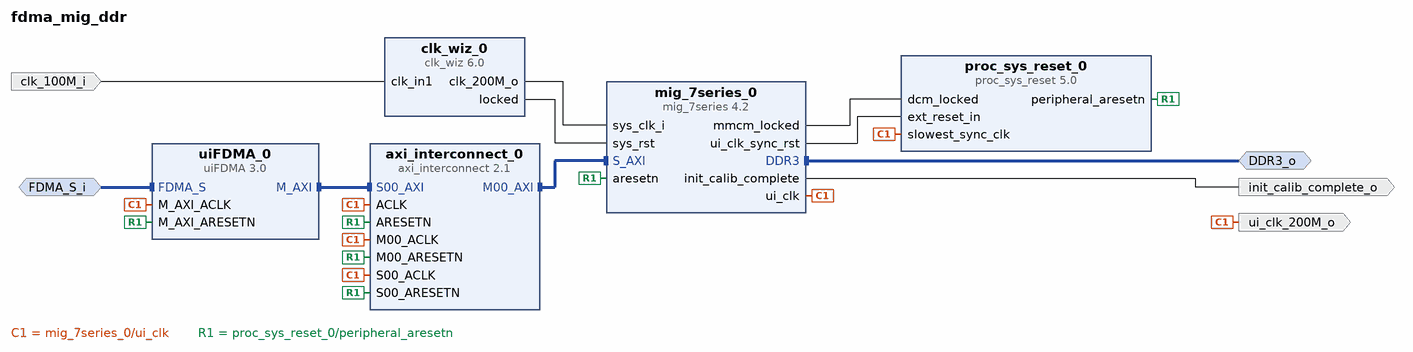
[diagram p0: block diagram of the top level]
# Vivado block design fdma_mig_ddr, xc7z035ffg676-2, Vivado 2021.2
create_bd_design fdma_mig_ddr

create_bd_intf_port -mode Slave -vlnv xilinx.com:user:FDMA_rtl:1.0 FDMA_S_i
create_bd_intf_port -mode Master -vlnv xilinx.com:interface:ddrx_rtl:1.0 DDR3_o
create_bd_port -dir I -type clk clk_100M_i
create_bd_port -dir O -type clk ui_clk_200M_o
set_property -dict {CONFIG.FREQ_HZ 200000000} [get_bd_ports ui_clk_200M_o]
create_bd_port -dir O init_calib_complete_o

create_bd_cell -type ip -vlnv xilinx.com:ip:axi_interconnect:2.1 axi_interconnect_0
set_property -dict {CONFIG.NUM_MI 1 CONFIG.S00_HAS_DATA_FIFO 2 CONFIG.S00_HAS_REGSLICE 1} [get_bd_cells axi_interconnect_0]
create_bd_cell -type ip -vlnv xilinx.com:ip:proc_sys_reset:5.0 proc_sys_reset_0
create_bd_cell -type ip -vlnv xilinx.com:user:uiFDMA:3.0 uiFDMA_0
create_bd_cell -type ip -vlnv xilinx.com:ip:clk_wiz:6.0 clk_wiz_0
set_property -dict [list \
  CONFIG.CLKOUT1_DRIVES BUFG \
  CONFIG.CLKOUT1_JITTER 114.829 \
  CONFIG.CLKOUT1_PHASE_ERROR 98.575 \
  CONFIG.CLKOUT1_REQUESTED_OUT_FREQ 200.000 \
  CONFIG.CLKOUT1_USED true \
  CONFIG.CLKOUT2_DRIVES BUFG \
  CONFIG.CLKOUT2_JITTER 111.164 \
  CONFIG.CLKOUT2_PHASE_ERROR 114.212 \
  CONFIG.CLKOUT2_REQUESTED_OUT_FREQ 400.000 \
  CONFIG.CLKOUT2_USED false \
  CONFIG.CLKOUT3_DRIVES BUFG \
  CONFIG.CLKOUT4_DRIVES BUFG \
  CONFIG.CLKOUT5_DRIVES BUFG \
  CONFIG.CLKOUT6_DRIVES BUFG \
  CONFIG.CLKOUT7_DRIVES BUFG \
  CONFIG.CLK_OUT1_PORT clk_200M_o \
  CONFIG.CLK_OUT2_PORT clk_400M_o \
  CONFIG.MMCM_CLKFBOUT_MULT_F 10.000 \
  CONFIG.MMCM_CLKOUT0_DIVIDE_F 5.000 \
  CONFIG.MMCM_CLKOUT1_DIVIDE 1 \
  CONFIG.NUM_OUT_CLKS 1 \
  CONFIG.RESET_PORT resetn \
  CONFIG.RESET_TYPE ACTIVE_LOW \
  CONFIG.SECONDARY_SOURCE Single_ended_clock_capable_pin \
  CONFIG.USE_PHASE_ALIGNMENT false \
  CONFIG.USE_RESET false \
] [get_bd_cells clk_wiz_0]
create_bd_cell -type ip -vlnv xilinx.com:ip:mig_7series:4.2 mig_7series_0
set_property -dict [list \
  CONFIG.BOARD_MIG_PARAM Custom \
  CONFIG.MIG_DONT_TOUCH_PARAM Custom \
  CONFIG.RESET_BOARD_INTERFACE Custom \
  CONFIG.XML_INPUT_FILE mig_b.prj \
] [get_bd_cells mig_7series_0]

# ---- connections ----

connect_bd_intf_net -intf_net FDMA_S_0_1 [get_bd_intf_ports FDMA_S_i] [get_bd_intf_pins uiFDMA_0/FDMA_S]
connect_bd_intf_net [get_bd_intf_pins axi_interconnect_0/M00_AXI] [get_bd_intf_pins mig_7series_0/S_AXI]
connect_bd_intf_net [get_bd_intf_ports DDR3_o] [get_bd_intf_pins mig_7series_0/DDR3]
connect_bd_intf_net [get_bd_intf_pins uiFDMA_0/M_AXI] [get_bd_intf_pins axi_interconnect_0/S00_AXI]
connect_bd_net -net clk_in1_0_1 [get_bd_ports clk_100M_i] [get_bd_pins clk_wiz_0/clk_in1]
connect_bd_net [get_bd_pins clk_wiz_0/clk_200M_o] [get_bd_pins mig_7series_0/sys_clk_i]
connect_bd_net [get_bd_pins clk_wiz_0/locked] [get_bd_pins mig_7series_0/sys_rst]
connect_bd_net [get_bd_pins mig_7series_0/init_calib_complete] [get_bd_ports init_calib_complete_o]
connect_bd_net [get_bd_pins mig_7series_0/mmcm_locked] [get_bd_pins proc_sys_reset_0/dcm_locked]
connect_bd_net [get_bd_pins mig_7series_0/ui_clk] \
  [get_bd_ports ui_clk_200M_o] [get_bd_pins axi_interconnect_0/ACLK] [get_bd_pins axi_interconnect_0/S00_ACLK] \
  [get_bd_pins axi_interconnect_0/M00_ACLK] [get_bd_pins uiFDMA_0/M_AXI_ACLK] [get_bd_pins proc_sys_reset_0/slowest_sync_clk]
connect_bd_net [get_bd_pins mig_7series_0/ui_clk_sync_rst] [get_bd_pins proc_sys_reset_0/ext_reset_in]
connect_bd_net [get_bd_pins proc_sys_reset_0/peripheral_aresetn] \
  [get_bd_pins mig_7series_0/aresetn] [get_bd_pins axi_interconnect_0/ARESETN] [get_bd_pins axi_interconnect_0/S00_ARESETN] \
  [get_bd_pins axi_interconnect_0/M00_ARESETN] [get_bd_pins uiFDMA_0/M_AXI_ARESETN]

# ---- address map ----
assign_bd_address -offset 0x80000000 -range 1G -target_address_space [get_bd_addr_spaces uiFDMA_0/M_AXI] [get_bd_addr_segs mig_7series_0/memmap/memaddr]

validate_bd_design
save_bd_design
